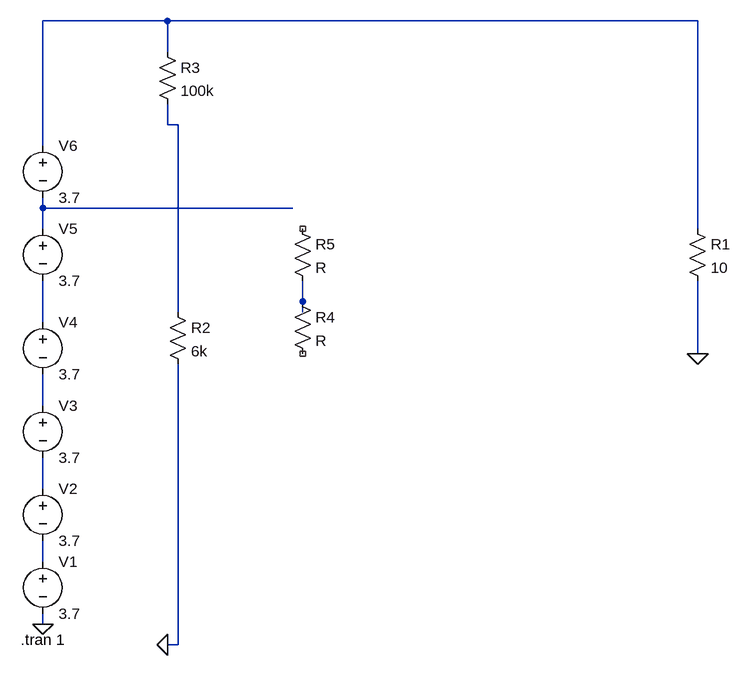
[diagram p0: schematic Draft1.asc]
Draft1.asc, the LTspice schematic file:
Version 4
SHEET 1 1240 680
WIRE 368 -576 176 -576
WIRE 1184 -576 368 -576
WIRE 368 -528 368 -576
WIRE 368 -416 368 -448
WIRE 384 -416 368 -416
WIRE 176 -384 176 -576
WIRE 176 -288 176 -304
WIRE 560 -288 176 -288
WIRE 176 -256 176 -288
WIRE 1184 -256 1184 -576
WIRE 576 -144 576 -176
WIRE 384 -128 384 -416
WIRE 576 -128 576 -144
WIRE 176 -112 176 -176
WIRE 1184 -64 1184 -176
WIRE 176 16 176 -32
WIRE 176 144 176 96
WIRE 176 256 176 224
WIRE 176 352 176 336
WIRE 384 384 384 -48
WIRE 384 384 368 384
FLAG 176 352 0
FLAG 1184 -64 0
FLAG 368 384 0
SYMBOL voltage 176 240 R0
WINDOW 123 0 0 Left 0
WINDOW 39 0 0 Left 0
SYMATTR InstName V1
SYMATTR Value 3.7
SYMBOL voltage 176 128 R0
WINDOW 123 0 0 Left 0
WINDOW 39 0 0 Left 0
SYMATTR InstName V2
SYMATTR Value 3.7
SYMBOL voltage 176 0 R0
WINDOW 123 0 0 Left 0
WINDOW 39 0 0 Left 0
SYMATTR InstName V3
SYMATTR Value 3.7
SYMBOL voltage 176 -128 R0
WINDOW 123 0 0 Left 0
WINDOW 39 0 0 Left 0
SYMATTR InstName V4
SYMATTR Value 3.7
SYMBOL voltage 176 -272 R0
WINDOW 123 0 0 Left 0
WINDOW 39 0 0 Left 0
SYMATTR InstName V5
SYMATTR Value 3.7
SYMBOL voltage 176 -400 R0
WINDOW 123 0 0 Left 0
WINDOW 39 0 0 Left 0
SYMATTR InstName V6
SYMATTR Value 3.7
SYMBOL res 1168 -272 R0
SYMATTR InstName R1
SYMATTR Value 10
SYMBOL res 352 -544 R0
SYMATTR InstName R3
SYMATTR Value 100k
SYMBOL res 368 -144 R0
SYMATTR InstName R2
SYMATTR Value 6k
SYMBOL res 560 -160 R0
SYMATTR InstName R4
SYMBOL res 560 -272 R0
SYMATTR InstName R5
TEXT 142 376 Left 2 !.tran 1

The netlist it stands for:
* Draft1.asc
V1 N008 0 3.7
V2 N007 N008 3.7
V3 N006 N007 3.7
V4 N005 N006 3.7
V5 N003 N005 3.7
V6 N001 N003 3.7
R1 N001 0 10
R3 N001 N002 100k
R2 N002 0 6k
R4 N004 NC_01 R
R5 NC_02 N004 R
.tran 1
.backanno
.end